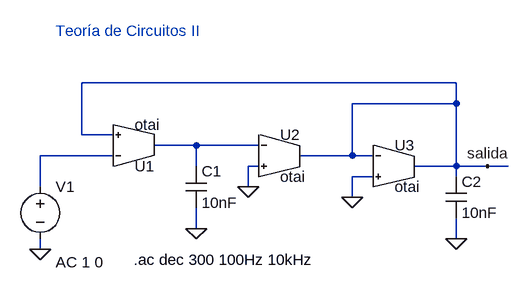
[diagram p0: schematic Filtro pasabajos con tres otas.asc]
Filtro pasabajos con tres otas.asc, the LTspice schematic file:
Version 4
SHEET 1 880 680
WIRE 640 48 64 48
WIRE 640 80 640 48
WIRE 640 80 480 80
WIRE 64 128 64 48
WIRE 112 128 64 128
WIRE 240 144 176 144
WIRE 336 144 240 144
WIRE 112 160 0 160
WIRE 480 160 480 80
WIRE 480 160 400 160
WIRE 512 160 480 160
WIRE 240 176 240 144
WIRE 336 176 320 176
WIRE 640 176 640 80
WIRE 640 176 576 176
WIRE 688 176 640 176
WIRE 720 176 688 176
WIRE 512 192 480 192
WIRE 640 192 640 176
WIRE 0 208 0 160
WIRE 320 208 320 176
WIRE 480 224 480 192
WIRE 240 272 240 240
WIRE 640 288 640 256
WIRE 0 304 0 288
FLAG 0 304 0
FLAG 320 208 0
FLAG 480 224 0
FLAG 640 288 0
FLAG 240 272 0
FLAG 688 176 salida
SYMBOL otai 144 208 M180
SYMATTR InstName U1
SYMATTR Value gm=62.83uS
SYMBOL otai 368 96 R0
SYMATTR InstName U2
SYMATTR Value gm=62.83uS
SYMBOL otai 544 112 R0
SYMATTR InstName U3
SYMATTR Value gm=7.854uS
SYMBOL voltage 0 192 R0
WINDOW 123 24 132 Left 0
WINDOW 39 0 0 Left 0
SYMATTR Value2 AC 1 0
SYMATTR InstName V1
SYMATTR Value ""
SYMBOL cap 224 176 R0
SYMATTR InstName C1
SYMATTR Value 10nF
SYMBOL cap 624 192 R0
SYMATTR InstName C2
SYMATTR Value 10nF
TEXT 144 320 Left 0 !.ac dec 300 100Hz 10kHz
TEXT 24 -32 Left 0 ;Teoría de Circuitos II

The netlist it stands for:
* Filtro pasabajos con tres otas.asc
XU1 salida N002 N001 otai gm=62.83uS  ; pins p n s
XU2 0 N001 salida otai gm=62.83uS  ; pins p n s
XU3 0 salida salida otai gm=7.854uS  ; pins p n s
V1 N002 0 AC 1 0
C1 N001 0 10nF
C2 salida 0 10nF
.ac dec 300 100Hz 10kHz
* Teoría de Circuitos II
.lib ..\sym\Circuitos2\ComponentesIdeales\compoideales.lib
.backanno
.end